# Altium project SmartGarden_PCB.PrjPcb (part 2 of 3)

## Sheet [2]MCU.SchDoc
size A4
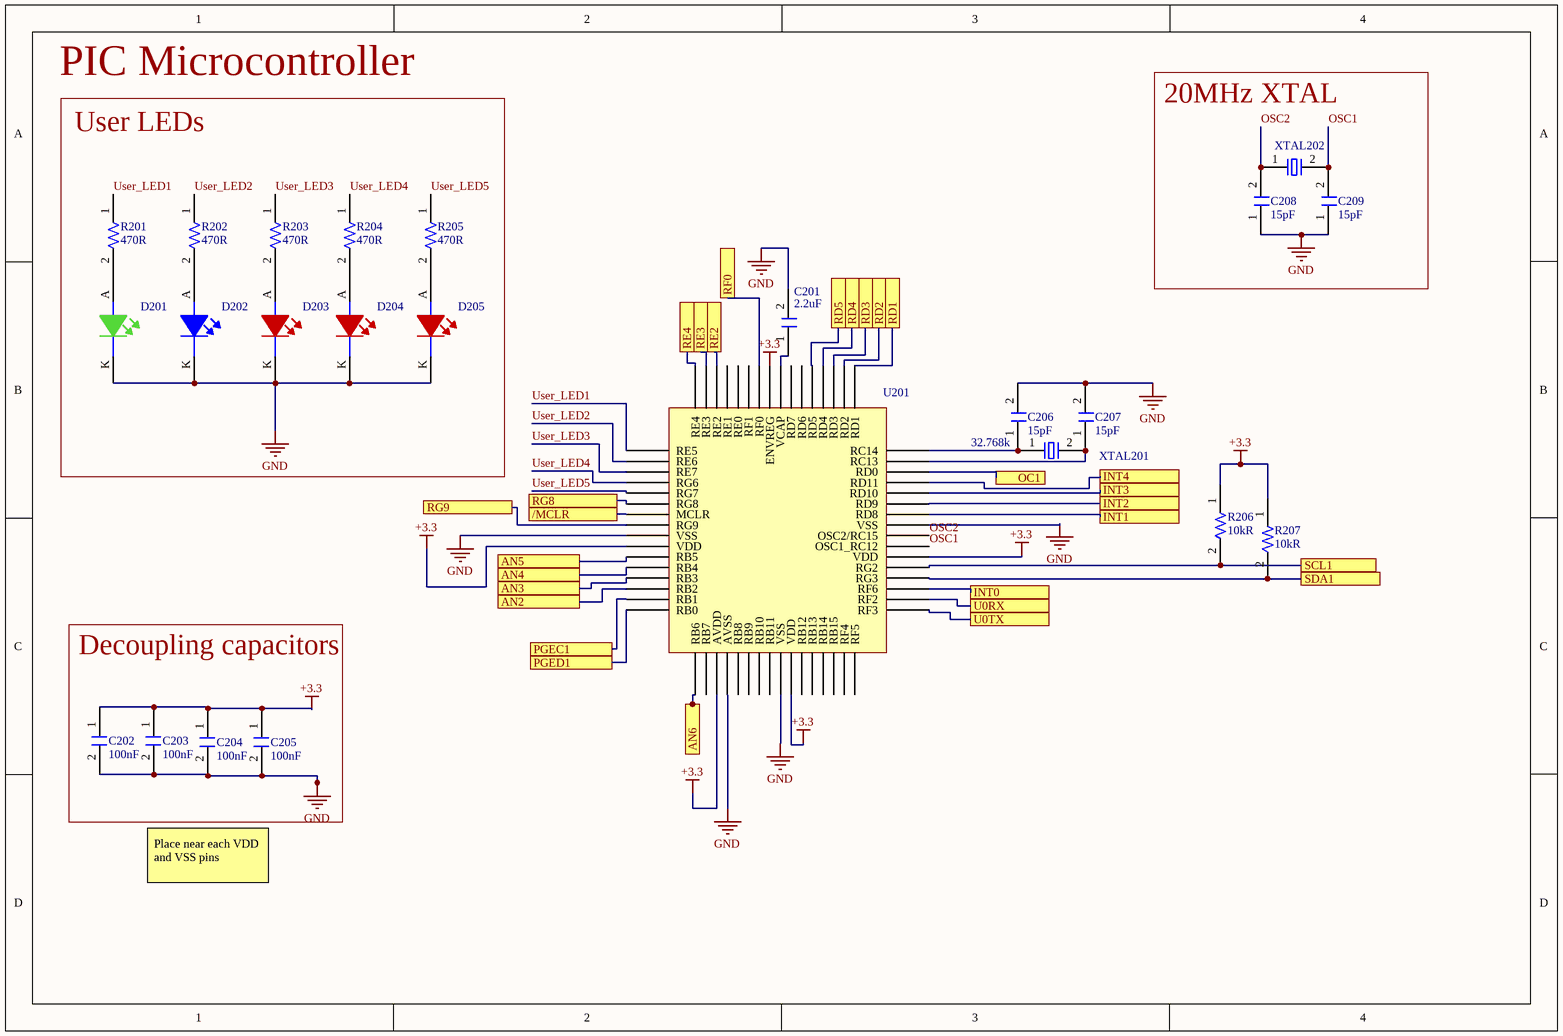
[diagram p2: [2]MCU.SchDoc]

### Parts
C201  2.2uF  [C0805FNPC-W]
C202  Capacitance: 100nF  [C0805FNPC-R]  (hidden comment: 885012207098)
C203  Capacitance: 100nF  [C0805FNPC-R]  (hidden comment: 885012207098)
C204  Capacitance: 100nF  [C0805FNPC-R]  (hidden comment: 885012207098)
C205  Capacitance: 100nF  [C0805FNPC-R]  (hidden comment: 885012207098)
C206  Capacitance: 15pF  [C1206FNPC-RW]  (hidden comment: 885012008038)
C207  Capacitance: 15pF  [C1206FNPC-RW]  (hidden comment: 885012008038)
C208  Capacitance: 15pF  [C1206FNPC-RW]  (hidden comment: 885012008038)
C209  Capacitance: 15pF  [C1206FNPC-RW]  (hidden comment: 885012008038)
D201  150080VS75000  [LED_0805_WE]  (value not drawn)
D202  150080BS75000  [LED_0805_WE]  (value not drawn)
D203  150080RS75000  [LED_0805_WE]  (value not drawn)
D204  150080RS75000  [LED_0805_WE]  (value not drawn)
D205  150080RS75000  [LED_0805_WE]  (value not drawn)
R201  Resistance: 470R  [R0805FTK]  (hidden comment: CR0805-FX-4700GLF)
R202  Resistance: 470R  [R0805FTK]  (hidden comment: CR0805-FX-4700GLF)
R203  Resistance: 470R  [R0805FTK]  (hidden comment: CR0805-FX-4700GLF)
R204  Resistance: 470R  [R0805FTK]  (hidden comment: CR0805-FX-4700GLF)
R205  Resistance: 470R  [R0805FTK]  (hidden comment: CR0805-FX-4700GLF)
R206  Resistance: 10kR  [R0805FTK]  (hidden comment: CR0805-JW-103ELF)
R207  Resistance: 10kR  [R0805FTK]  (hidden comment: CR0805-JW-103ELF)
U201  PIC32MX340F512H  [QFP50P1200X1200X120_64N]  (value not drawn)
XTAL201  32.768k  [XTAL_ABS06-32.768KHZ-9-T]
XTAL202  830028710  [XTAL20M_SMD]  (value not drawn)

### Blocks framed on the sheet
20MHz XTAL: C208 C209 XTAL202
PIC Microcontroller: D201-D205 R201-R205
Decoupling capacitors: C202-C205

### Ports
/MCLR, AN2, AN3, AN4, AN5, AN6, INT0, INT1, INT2, INT3, INT4, OC1, PGEC1, PGED1, RD1, RD2, RD3, RD4, RD5, RE2, RE3, RE4, RF0, RG8, RG9, SCL1, SDA1, U0RX, U0TX

### Nets
+3.3: C202.1 C203.1 C204.1 C205.1 R206.1 R207.1 U201.10(VDD) U201.19(AVDD) U201.26(VDD) U201.38(VDD) U201.57(ENVREG)
GND: C201.2 C202.2 C203.2 C204.2 C205.2 C206.2 C207.2 C208.1 C209.1 D201.K D202.K D203.K D204.K D205.K U201.9(VSS) U201.20(AVSS) U201.25(VSS) U201.41(VSS)
/MCLR: U201.7(MCLR) ; port /MCLR
DPS_SCL: R206.2 U201.37(RG2) ; port SCL1
DPS_SDA: R207.2 U201.36(RG3) ; port SDA1
GH_D: U201.8(RG9) ; port RG9
GH_Vout: U201.17(RB6) ; port AN6
HR_Vout: U201.11(RB5) ; port AN5
LDR_Vout: U201.13(RB3) ; port AN3
NTC_Vadc: U201.12(RB4) ; port AN4
OSC1: C209.2 U201.39(OSC1_RC12) XTAL202.2
OSC2: C208.2 U201.40(OSC2/RC15) XTAL202.1
PGEC1: U201.15(RB1) ; port PGEC1
PGED1: U201.16(RB0) ; port PGED1
Rain_D: U201.6(RG8) ; port RG8
Rain_Vout: U201.14(RB2) ; port AN2
RD1: U201.49(RD1) ; port RD1
RD2: U201.50(RD2) ; port RD2
RD3: U201.51(RD3) ; port RD3
RD4: U201.52(RD4) ; port RD4
RD5: U201.53(RD5) ; port RD5
User_LED1: R201.1 U201.1(RE5)
User_LED2: R202.1 U201.2(RE6)
User_LED3: R203.1 U201.3(RE7)
User_LED4: R204.1 U201.4(RG6)
User_LED5: R205.1 U201.5(RG7)
NetC201_1: C201.1 U201.56(VCAP)
NetC206_1: C206.1 U201.48(RC14) XTAL201.1
NetC207_1: C207.1 U201.47(RC13) XTAL201.2
NetC401_1: U201.35(RF6) ; port INT0
NetC402_1: U201.42(RD8) ; port INT1
NetC403_1: U201.43(RD9) ; port INT2
NetC404_1: U201.44(RD10) ; port INT3
NetC405_1: U201.45(RD11) ; port INT4
NetD201_A: D201.A R201.2
NetD202_A: D202.A R202.2
NetD203_A: D203.A R203.2
NetD204_A: D204.A R204.2
NetD205_A: D205.A R205.2
NetR414_1: U201.46(RD0) ; port OC1
NetR416_1: U201.58(RF0) ; port RF0
NetR418_2: U201.64(RE4) ; port RE4
NetU201_33: U201.33(RF3) ; port U0TX
NetU201_34: U201.34(RF2) ; port U0RX
NetU201_62: U201.62(RE2) ; port RE2
NetU201_63: U201.63(RE3) ; port RE3

Not connected (* = marked no-connect by the designer): U201 18(RB7) 21(RB8) 22(RB9) 23(RB10) 24(RB11) 27(RB12) 28(RB13) 29(RB14) 30(RB15) 31(RF4) 32(RF5) 54(RD6) 55(RD7) 59(RF1) 60(RE0) 61(RE1)

### Notes on the sheet
- User LEDs
- Place near each VDD and VSS pins

### Library data of the parts
C201 = C2.2u-16V-0805FTK
C202-C205 = C100n-50V-0805FNPC-X7R: Cap, 0.1ΜF, 50V, 10%, X7R, 0805; Manufacturer 1: Wurth Electronics; .Creator: DR; Supplier 1: RSComponents; Manufacturer Part Number 1: 885012207098; RoHS: Yes; Category: Ceramic Capacitors; Stock 1: 8000; Pricing 1: 100=0,10200, 500=0,07100, 2000=0,06100 (GBP); Mount: Surface Mount; Case/Package: 0805; Case Code (Metric): 2012; Case Code (Imperial): 0805; Min Operating Temperature: -55°C; Max Operating Temperature: 125°C; Packaging: Cut Tape; Voltage Rating: 50V; Dielectric: X7R; Tolerance: 10%; Voltage Rating (DC): 50V; Length: 0.079inch; Width: 0.049inch; Thickness: 0.035inch; REACH SVHC: Unknown; RoHS Compliant: Yes; ComponentLink1URL: http://www.farnell.com/datasheets/1958498.pdf?src-supplier=Farnell; ComponentLink1Description: http://www.farnell.com/datasheets/1958498.pdf?src-supplier=Farnell; ComponentLink2URL: http://www.farnell.com/datasheets/1958498.pdf?src-supplier=Element14; ComponentLink2Description: http://www.farnell.com/datasheets/1958498.pdf?src-supplier=Element14; ComponentLink3URL: https://katalog.we-online.de/pbs/datasheet/885012207098.pdf?src-supplier=Digi-Key; ComponentLink3Description: https://katalog.we-online.de/pbs/datasheet/885012207098.pdf?src-supplier=Digi-Key; ComponentLink4URL: http://www.farnell.com/datasheets/1958498.pdf?src-supplier=Newark; ComponentLink4Description: http://www.farnell.com/datasheets/1958498.pdf?src-supplier=Newark; Supplier Part Number 1: 1813493
C206-C209 = C15p-50V-1206FNPC-NP0: Cap, 15Pf, 50V, 5%, C0G/np0, 1206 Rohs Compliant: Yes; Manufacturer: Wurth Electronics; .Creator: GP; Category: Capacitor; ComponentLink1Description: Datasheet; ComponentLink1URL: https://www.we-online.com/catalog/datasheet/885012008038.pdf; ComponentLink2Description: Where buy it; ComponentLink2URL: https://www.we-online.com/catalog/en/WCAP-CSGP-50VDC?sq=885012008038#885012008038; Supplier 1: Digi-Key; Manufacturer Part Number: 885012008038; RoHS: Yes; Stock 1: 6999; Pricing 1: 1=0,11000, 10=0,10000, 100=0,09000, 500=0,08000 (USD); Mount: Surface Mount; Case/Package: 1206; Case Code (Metric): 3216; Case Code (Imperial): 1206; Min Operating Temperature: -55°C; Max Operating Temperature: 125°C; Packaging: Tape and Reel; Voltage Rating: 50V; Tolerance: 5%; Length: 0.126inch; Width: 0.063inch; Thickness: 0.035inch; RoHS Compliant: Yes; ComponentLink3URL: http://www.farnell.com/datasheets/2546700.pdf?src-supplier=Farnell; ComponentLink3Description: http://www.farnell.com/datasheets/2546700.pdf?src-supplier=Farnell; ComponentLink4URL: https://katalog.we-online.de/pbs/datasheet/885012008038.pdf?src-supplier=Digi-Key; ComponentLink4Description: https://katalog.we-online.de/pbs/datasheet/885012008038.pdf?src-supplier=Digi-Key; Supplier Part Number 1: 732-7882-1-ND
D201 = LEDVS-0805-40: Led, Green, 570 Nm, 2 V, 30 Ma, 40 Mcd Rohs Compliant: Yes; Manufacturer 1: Wurth Electronics; Luminous Intensity: 40mcd; Forward Current: 30mA; Forward Voltage: 2V; Viewing Angle: 140°; Wavelength: 570nm; Lens Style: Clear,Rectangular; Test Current: 20mA; .Creator: DR; ComponentLink1Description: Datasheet; ComponentLink1URL: https://www.we-online.com/catalog/datasheet/150080VS75000.pdf; ComponentLink2Description: Where buy it; ComponentLink2URL: https://katalog.we-online.de/en/led/WL-SMCW/150080VS75000; Supplier 1: RSComponents; Manufacturer Part Number 1: 150080VS75000; RoHS: Yes; Category: LEDs; Stock 1: 850; Pricing 1: 50=0,19300, 500=0,12900, 1000=0,12300, 2000=0,11700, 4000=0,11100 (USD); Mount: Surface Mount; Case/Package: 0805; Case Code (Metric): 2012; Case Code (Imperial): 0805; Min Operating Temperature: -40°C; Max Operating Temperature: 85°C; Package Quantity: 4000; Packaging: Tape and Reel; Dominant Wavelength: 570nm; Length: 2mm; Width: 1.25mm; Height: 0.7mm; REACH SVHC: Unknown; ComponentLink3URL: https://datasheet.ciiva.com/22656/150080vs75000-22656966.pdf?src-supplier=Element14; ComponentLink3Description: https://datasheet.ciiva.com/22656/150080vs75000-22656966.pdf?src-supplier=Element14; ComponentLink4URL: https://datasheet.ciiva.com/29279/759437-da-01-en-chipled-0805-w-kl-h-gruen-150080vs7500-29279047.pdf?src-supplier=Conrad; ComponentLink4Description: https://datasheet.ciiva.com/29279/759437-da-01-en-chipled-0805-w-kl-h-gruen-150080vs7500-29279047.pdf?src-supplier=Conrad; ComponentLink5URL: https://datasheet.ciiva.com/29563/150080vs75000-29563018.pdf?src-supplier=Digi-Key; ComponentLink5Description: https://datasheet.ciiva.com/29563/150080vs75000-29563018.pdf?src-supplier=Digi-Key; Supplier Part Number 1: 8154237; Color: Green
D202 = LEDBS-0805-145: LED BLUE CLEAR 0805 SMD; Manufacturer 1: Wurth Electronics; Luminous Intensity: 145mcd; Viewing Angle: 140°; Forward Voltage: 3.2V; Wavelength: 470nm; Lens Style: Clear,Rectangular; Forward Current: 30mA; Test Current: 20mA; .Creator: GP; ComponentLink1Description: Datasheet; ComponentLink1URL: https://www.we-online.com/catalog/datasheet/150080BS75000.pdf; ComponentLink2Description: Where buy it; ComponentLink2URL: https://katalog.we-online.de/en/led/WL-SMCW/150080BS75000; Supplier 1: RSComponents; Manufacturer Part Number 1: 150080BS75000; RoHS: Yes; Category: LEDs; Stock 1: 7400; Pricing 1: 50=0,19300, 500=0,12900, 1000=0,12200, 2000=0,11700, 4000=0,11100 (USD); Mount: Surface Mount; Case/Package: 0805; Case Code (Metric): 2012; Case Code (Imperial): 0805; Min Operating Temperature: -40°C; Max Operating Temperature: 85°C; Package Quantity: 4000; Packaging: Tape and Reel; Dominant Wavelength: 470nm; Length: 2mm; Width: 1.25mm; Height: 0.7mm; REACH SVHC: Unknown; RoHS Compliant: Yes; Lead Free: Lead Free; ComponentLink3URL: https://datasheet.ciiva.com/23843/150080bs75000-23843251.pdf?src-supplier=Newark; ComponentLink3Description: https://datasheet.ciiva.com/23843/150080bs75000-23843251.pdf?src-supplier=Newark; ComponentLink4URL: https://datasheet.ciiva.com/22656/1740214-22656954.pdf?src-supplier=Element14; ComponentLink4Description: https://datasheet.ciiva.com/22656/1740214-22656954.pdf?src-supplier=Element14; ComponentLink5URL: https://datasheet.ciiva.com/29279/759433-da-01-en-chipled-0805-w-kl-blau-150080bs75000-29279203.pdf?src-supplier=Conrad; ComponentLink5Description: https://datasheet.ciiva.com/29279/759433-da-01-en-chipled-0805-w-kl-blau-150080bs75000-29279203.pdf?src-supplier=Conrad; ComponentLink6URL: https://datasheet.ciiva.com/29562/150080bs75000-29562922.pdf?src-supplier=Digi-Key; ComponentLink6Description: https://datasheet.ciiva.com/29562/150080bs75000-29562922.pdf?src-supplier=Digi-Key; ComponentLink7URL: https://datasheet.ciiva.com/29562/150080bs75000-29562923.pdf?src-supplier=Digi-Key; ComponentLink7Description: https://datasheet.ciiva.com/29562/150080bs75000-29562923.pdf?src-supplier=Digi-Key; Supplier Part Number 1: 8154228; Color: Blue
D203-D205 = LEDRS-0805-150: 0805(H=0.8mm) 红色 高亮 λD=625nm VF=2V IF=30mA PD=72mW; Manufacturer 1: Wurth Electronics; Luminous Intensity: 150mcd; Viewing Angle: 140°; Forward Voltage: 2V; Wavelength: 625nm; Lens Style: Clear,Rectangular; Forward Current: 30mA; Test Current: 20mA; .Creator: DR; Color: Red; ComponentLink1Description: Datasheet; ComponentLink1URL: https://www.we-online.com/catalog/datasheet/150080RS75000.pdf; ComponentLink2Description: Where buy it; ComponentLink2URL: https://katalog.we-online.de/en/led/WL-SMCW/150080RS75000; Supplier 1: RSComponents; Manufacturer Part Number 1: 150080RS75000; RoHS: Yes; Category: LEDs; Stock 1: 1; Pricing 1: 50=0,19300, 500=0,12900, 1000=0,12300, 2000=0,11700, 4000=0,11100 (USD); Mount: Surface Mount; Case/Package: 0805; Case Code (Metric): 2012; Case Code (Imperial): 0805; Min Operating Temperature: -40°C; Max Operating Temperature: 85°C; Package Quantity: 4000; Packaging: Tape and Reel; Dominant Wavelength: 625nm; Length: 2mm; Width: 1.25mm; Height: 0.7mm; REACH SVHC: Unknown; RoHS Compliant: Yes; ComponentLink3URL: https://datasheet.ciiva.com/22656/150080rs75000-22656961.pdf?src-supplier=Element14; ComponentLink3Description: https://datasheet.ciiva.com/22656/150080rs75000-22656961.pdf?src-supplier=Element14; ComponentLink4URL: https://datasheet.ciiva.com/29279/759435-da-01-en-chipled-0805-w-kl-rot-150080rs75000-29279032.pdf?src-supplier=Conrad; ComponentLink4Description: https://datasheet.ciiva.com/29279/759435-da-01-en-chipled-0805-w-kl-rot-150080rs75000-29279032.pdf?src-supplier=Conrad; Supplier Part Number 1: 8154225P
R201-R205 = R470-0805FTK: Res Thick Film 0805 470 Ohm 1% 1/8W ±100ppm/°C Molded SMD SMD Paper Tape on Plastic Reel; Manufacturer 1: Bourns; Power Rating: 125mW; Voltage Rating: 150V; .Creator: DR; Supplier 1: Arrow Electronics; Manufacturer Part Number 1: CR0805-FX-4700GLF; RoHS: Yes; Category: Chip SMD Resistors; Stock 1: 12623; Pricing 1: 1=0,00990, 10=0,00980, 25=0,00950, 50=0,00940, 100=0,00930, 250=0,00920, 500=0,00910, 1000=0,00890, 3000=0,00870, 6000=0,00860 (USD); Mount: Surface Mount; Case/Package: 0805; Number of Pins: 2; Case Code (Imperial): 0805; Case Code (Metric): 2012; Contact Plating: Tin; Min Operating Temperature: -55°C; Max Operating Temperature: 155°C; Packaging: Tape and Reel; Tolerance: 1%; Resistor Type: Thick Film; Termination: SMD/SMT; Temperature Coefficient: 100ppm/°C; Voltage Rating (DC): 150V; Features: Moisture Resistant; Series: CR0805; Max Power Dissipation: 125mW; Number of Terminations: 2; Resistance Tolerance: 1%; Construction: Rectangular; Technology: THICK FILM; Length: 2mm; Height: 0.5mm; Depth: 1.25mm; Thickness: 508um; Radiation Hardening: No; REACH SVHC: No SVHC; Military Standard: Not; ComponentLink1URL: https://datasheet.ciiva.com/11808/0900766b80fcdb72-11808686.pdf?src-supplier=RSComponents; ComponentLink1Description: https://datasheet.ciiva.com/11808/0900766b80fcdb72-11808686.pdf?src-supplier=RSComponents; ComponentLink2URL: https://datasheet.ciiva.com/7985/1856384-7985880.pdf?src-supplier=Element14; ComponentLink2Description: https://datasheet.ciiva.com/7985/1856384-7985880.pdf?src-supplier=Element14; ComponentLink3URL: https://datasheet.ciiva.com/22693/1902866-22693247.pdf?src-supplier=Element14; ComponentLink3Description: https://datasheet.ciiva.com/22693/1902866-22693247.pdf?src-supplier=Element14; ComponentLink4URL: https://datasheet.ciiva.com/5541/chpreztr-5541930.pdf?src-supplier=Mouser; ComponentLink4Description: https://datasheet.ciiva.com/5541/chpreztr-5541930.pdf?src-supplier=Mouser; Supplier Part Number 1: CR0805-FX-4700GLF
R206 R207 = R10k-0805FTK: BOURNS         CR0805-JW-103ELF            Surface Mount Chip Resistor, Thick Film, CR Series, 10 kohm, 125 mW,  5%, 150 V; Temperature Coefficient: 200ppm/°C; Power Rating: 125mW; Voltage Rating: 150V; Voltage Rating (DC): 100V; .Creator: DR; Supplier 1: Arrow Electronics; Manufacturer 1: Bourns; Manufacturer Part Number 1: CR0805-JW-103ELF; RoHS: Yes; Category: Chip SMD Resistors; Stock 1: 57566; Pricing 1: 1=0,05790, 10=0,01540, 25=0,01340, 100=0,00340 (USD); Mount: Surface Mount; Case/Package: 0805; Number of Pins: 2; Contact Plating: Tin; Case Code (Metric): 2012; Case Code (Imperial): 0805; Min Operating Temperature: -55°C; Max Operating Temperature: 155°C; Tolerance: 5%; Resistor Type: Thick Film; Package Quantity: 1; Packaging: Tape and Reel; Number of Terminations: 2; Termination: SMD/SMT; Max Power Dissipation: 125mW; Features: Moisture Resistant; Series: CR0805; Construction: Rectangular; Resistance Tolerance: 5%; Technology: THICK FILM; Length: 2mm; Width: 1.25mm; Height: 0.5mm; Depth: 1.25mm; Thickness: 508um; Radiation Hardening: No; REACH SVHC: No SVHC; Military Standard: Not; RoHS Compliant: Yes; ComponentLink1URL: https://datasheet.ciiva.com/11821/0900766b80fcdb72-11821135.pdf?src-supplier=RSComponents; ComponentLink1Description: https://datasheet.ciiva.com/11821/0900766b80fcdb72-11821135.pdf?src-supplier=RSComponents; ComponentLink2URL: https://datasheet.ciiva.com/9122/chpreztr-9122374.pdf?src-supplier=Avnet; ComponentLink2Description: https://datasheet.ciiva.com/9122/chpreztr-9122374.pdf?src-supplier=Avnet; ComponentLink3URL: https://datasheet.ciiva.com/22693/1902866-22693254.pdf?src-supplier=Element14; ComponentLink3Description: https://datasheet.ciiva.com/22693/1902866-22693254.pdf?src-supplier=Element14; ComponentLink4URL: https://datasheet.ciiva.com/7986/691949-7986187.pdf?src-supplier=Element14; ComponentLink4Description: https://datasheet.ciiva.com/7986/691949-7986187.pdf?src-supplier=Element14; ComponentLink5URL: https://datasheet.ciiva.com/30065/159chpreztr-30065976.pdf?src-supplier=Onlinecomponents.com; ComponentLink5Description: https://datasheet.ciiva.com/30065/159chpreztr-30065976.pdf?src-supplier=Onlinecomponents.com; ComponentLink6URL: https://datasheet.ciiva.com/16783/70154685-16783482.pdf?src-supplier=Allied+Electronics; ComponentLink6Description: https://datasheet.ciiva.com/16783/70154685-16783482.pdf?src-supplier=Allied+Electronics; ComponentLink7URL: https://datasheet.ciiva.com/5548/chpreztr-5548491.pdf?src-supplier=Mouser; ComponentLink7Description: https://datasheet.ciiva.com/5548/chpreztr-5548491.pdf?src-supplier=Mouser; ComponentLink8URL: https://datasheet.ciiva.com/6559/chpreztr-6559900.pdf?src-supplier=Digi-Key; ComponentLink8Description: https://datasheet.ciiva.com/6559/chpreztr-6559900.pdf?src-supplier=Digi-Key; ComponentLink9URL: https://datasheet.ciiva.com/6559/chpreztr-6559901.pdf?src-supplier=Digi-Key; ComponentLink9Description: https://datasheet.ciiva.com/6559/chpreztr-6559901.pdf?src-supplier=Digi-Key; ComponentLink10URL: https://datasheet.ciiva.com/7985/1856384-7985869.pdf?src-supplier=Element14; ComponentLink10Description: https://datasheet.ciiva.com/7985/1856384-7985869.pdf?src-supplier=Element14; ComponentLink11URL: https://datasheet.ciiva.com/48692/001055517-da-01-en-smd-wid-cr0805-jw-103elf-10k-ohm-1-8w-48692118.pdf?src-supplier=Conrad; ComponentLink11Description: https://datasheet.ciiva.com/48692/001055517-da-01-en-smd-wid-cr0805-jw-103elf-10k-ohm-1-8w-48692118.pdf?src-supplier=Conrad; Supplier Part Number 1: CR0805-JW-103ELF
XTAL201 = XTAL_SMD_32.768kHz
XTAL202 = XTAL20M_SMD: 830028710, 20 MHz; Manufacturer: Würth Elektronik; Frequency: 20 MHz; Frequency Stability: +-50 ppm; Drive level: 500µW max; .Creator: GP; Category: XTAL; ComponentLink1Description: Datasheet; ComponentLink1URL: https://www.we-online.com/catalog/datasheet/830028710.pdf; ComponentLink2Description: Where buy it; Package: *; Manufacturer part number: 830028710; Supplier: Würth Elektronik; Packaging: Reel; Max operating temperature.: 85ºC; Min operating temperature: -40ºC; Max power dissipation: *; Power rating: *; RoHS: Yes; Number of pins: 2; Type: SMD; Supplier 1: Digi-Key; Stock 1: 975; Pricing 1: 1=0,37000, 10=0,28100, 50=0,26800, 100=0,24400, 500=0,22000 (USD); Supplier Part Number 1: 1923-830028710CT-ND

## Sheet [3]Sensors.SchDoc
size A4
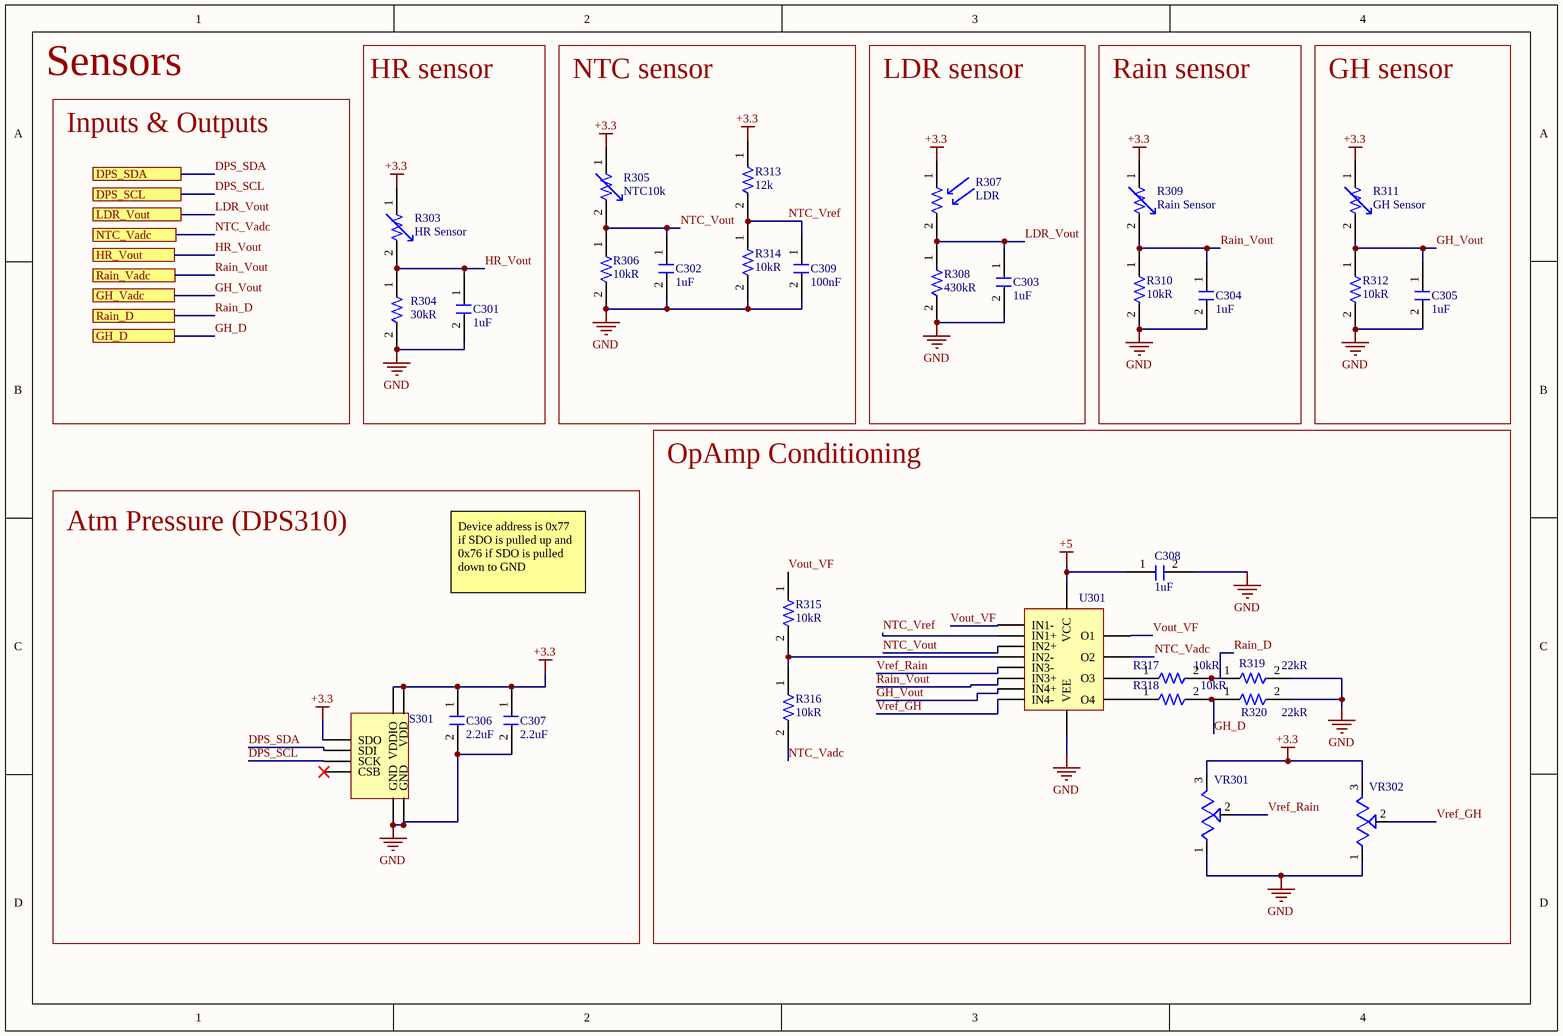
[diagram p3: [3]Sensors.SchDoc]

### Parts
C301  Capacitance: 1uF  [C1206FNPC-RW]  (hidden comment: 885012208036)
C302  Capacitance: 1uF  [C1206FNPC-RW]  (hidden comment: 885012208036)
C303  Capacitance: 1uF  [C1206FNPC-RW]  (hidden comment: 885012208036)
C304  Capacitance: 1uF  [C1206FNPC-RW]  (hidden comment: 885012208036)
C305  Capacitance: 1uF  [C1206FNPC-RW]  (hidden comment: 885012208036)
C306  2.2uF  [C0805FNPC-W]
C307  2.2uF  [C0805FNPC-W]
C308  Capacitance: 1uF  [C1206FNPC-RW]  (hidden comment: 885012208036)
C309  Capacitance: 100nF  [C1206FNPC-RW]  (hidden comment: 885012208009)
R303  HR Sensor  [HR_Sensor]
R304  Resistance: 30kR  [R1206FTK-W]  (hidden comment: CRCW120630K0FKEA)
R305  NTC10k  [NTC10k_0805]
R306  Resistance: 10kR  [R0805FTK]  (hidden comment: CR0805-JW-103ELF)
R307  LDR  [HR_Sensor]
R308  430kR  [R0805FTK]
R309  Rain Sensor  [EXTERNAL_SENSOR]
R310  Resistance: 10kR  [R0805FTK]  (hidden comment: CR0805-JW-103ELF)
R311  GH Sensor  [EXTERNAL_SENSOR]
R312  Resistance: 10kR  [R0805FTK]  (hidden comment: CR0805-JW-103ELF)
R313  12k  [R1206]
R314  Resistance: 10kR  [R0805FTK]  (hidden comment: CR0805-JW-103ELF)
R315  Resistance: 10kR  [R0805FTK]  (hidden comment: CR0805-JW-103ELF)
R316  Resistance: 10kR  [R0805FTK]  (hidden comment: CR0805-JW-103ELF)
R317  Resistance: 10kR  [R0805FTK]  (hidden comment: CR0805-JW-103ELF)
R318  Resistance: 10kR  [R0805FTK]  (hidden comment: CR0805-JW-103ELF)
R319  22kR  [R0805FTK]
R320  22kR  [R0805FTK]
S301  DPS310XTSA1  [XDCR_DPS310XTSA1]  (value not drawn)
U301  OpAmp  [LM324_OpAmp]  (value not drawn)
VR301  Trimmer_10k_THT  [TRIM_3362P-1-103LF]  (value not drawn)
VR302  Trimmer_10k_THT  [TRIM_3362P-1-103LF]  (value not drawn)

### Blocks framed on the sheet
HR sensor: C301 R303 R304
NTC sensor: C302 C309 R305 R306 R313 R314
LDR sensor: C303 R307 R308
Rain sensor: C304 R309 R310
GH sensor: C305 R311 R312
OpAmp Conditioning: C308 R315-R320 U301 VR301 VR302
Atm Pressure (DPS310): C306 C307 S301

### Ports
DPS_SCL, DPS_SDA, GH_D, GH_Vadc, HR_Vout, LDR_Vout, NTC_Vadc, Rain_D, Rain_Vadc

### Nets
+3.3: C306.1 C307.1 R303.1 R305.1 R307.1 R309.1 R311.1 R313.1 S301.5(SDO) S301.6(VDDIO) S301.8(VDD) VR301.3(CW) VR302.3(CW)
+5: C308.1 U301.4(VCC)
GND: C301.2 C302.2 C303.2 C304.2 C305.2 C306.2 C307.2 C308.2 C309.2 R304.2 R306.2 R308.2 R310.2 R312.2 R314.2 R319.2 R320.2 S301.1(GND) S301.7(GND) U301.11(VEE) VR301.1(CCW) VR302.1(CCW)
DPS_SCL: S301.4(SCK) ; port DPS_SCL
DPS_SDA: S301.3(SDI) ; port DPS_SDA
GH_D: R318.2 R320.1 ; port GH_D
GH_Vout: C305.1 R311.2 R312.1 U301.12(IN4+) ; port GH_Vadc
HR_Vout: C301.1 R303.2 R304.1 ; port HR_Vout
LDR_Vout: C303.1 R307.2 R308.1 ; port LDR_Vout
NTC_Vadc: R316.2 U301.7(O2) ; port NTC_Vadc
NTC_Vout: C302.1 R305.2 R306.1 U301.5(IN2+)
NTC_Vref: C309.1 R313.2 R314.1 U301.3(IN1+)
Rain_D: R317.2 R319.1 ; port Rain_D
Rain_Vout: C304.1 R309.2 R310.1 U301.10(IN3+) ; port Rain_Vadc
Vout_VF: R315.1 U301.1(O1) U301.2(IN1-)
Vref_GH: U301.13(IN4-) VR302.2(WIPER)
Vref_Rain: U301.9(IN3-) VR301.2(WIPER)
NetR315_2: R315.2 R316.1 U301.6(IN2-)
NetR317_1: R317.1 U301.8(O3)
NetR318_1: R318.1 U301.14(O4)

Not connected (* = marked no-connect by the designer): S301 2(CSB)*

### Notes on the sheet
- Sensors
- Inputs & Outputs
- Device address is 0x77 if SDO is pulled up and 0x76 if SDO is pulled down to GND

### Library data of the parts
C301-C305 C308 = C1u-16V-1206FNPC-X7R: Cap Cer 1UF 16V X7R 1206; Manufacturer: Wurth Electronics; Tolerance: 10%; .Creator: GP; Category: Capacitor; ComponentLink1Description: Datasheet; ComponentLink1URL: https://www.we-online.com/catalog/datasheet/885012208036.pdf; ComponentLink2Description: Where buy it; ComponentLink2URL: https://www.we-online.com/catalog/en/WCAP-CSGP-16VDC#885012208036; Supplier 1: Mouser; Manufacturer Part Number: 885012208036; RoHS: Yes; Stock 1: 5938; Pricing 1: 1=0,15000, 10=0,13900, 50=0,13900, 100=0,12400, 500=0,11000, 1000=0,11000, 3000=0,09100, 10000=0,09100 (USD); Mount: Surface Mount; Case/Package: 1206; Case Code (Metric): 3216; Case Code (Imperial): 1206; Min Operating Temperature: -55°C; Max Operating Temperature: 125°C; Packaging: Tape and Reel; Voltage Rating: 16V; Length: 0.126inch; Width: 0.063inch; Thickness: 0.051inch; RoHS Compliant: Yes; Supplier Part Number 1: 710-885012208036
C306 C307 = C2.2u-16V-0805FTK
C309 = C100n-10V-1206FNPC-X7R: Cap, 0.1ΜF, 10V, 10%, X7R, 1206; Manufacturer 1: Wurth Electronics; .Creator: GP; Supplier 1: Digi-Key; Manufacturer Part Number 1: 885012208009; RoHS: Yes; Category: Ceramic Capacitors; Stock 1: 7198; Pricing 1: 1=0,11000, 10=0,10300, 100=0,09200, 500=0,08100 (USD); Mount: Surface Mount; Case/Package: 1206; Case Code (Metric): 3216; Case Code (Imperial): 1206; Min Operating Temperature: -55°C; Max Operating Temperature: 125°C; Packaging: Tape and Reel; Voltage Rating: 10V; Tolerance: 10%; Length: 0.126inch; Width: 0.063inch; Thickness: 0.035inch; RoHS Compliant: Yes; ComponentLink1URL: http://www.farnell.com/datasheets/2031891.pdf?src-supplier=Farnell; ComponentLink1Description: http://www.farnell.com/datasheets/2031891.pdf?src-supplier=Farnell; ComponentLink2URL: http://katalog.we-online.de/pbs/datasheet/885012208009.pdf?src-supplier=Digi-Key; ComponentLink2Description: http://katalog.we-online.de/pbs/datasheet/885012208009.pdf?src-supplier=Digi-Key; ComponentLink3URL: https://katalog.we-online.de/pbs/datasheet/885012208009.pdf?src-supplier=Digi-Key; ComponentLink3Description: https://katalog.we-online.de/pbs/datasheet/885012208009.pdf?src-supplier=Digi-Key; Supplier Part Number 1: 732-8086-1-ND; ComponentLink4Description: Wurth Elektronik; ComponentLink4URL: https://www.we-online.com/catalog/en/WCAP-CSGP-10VDC?sq=885012208009#885012208009
R303 = Resistive_HR_Sensor: Resistive HR Sensor. R30k at 60%@25ºC
R304 = R30k-1206FTK: Res Thick Film 1206 30K Ohm 1% 1/4W ±100ppm/°C Molded SMD SMD Paper T/R; Manufacturer: Vishay; Power Rating: 250mW; Voltage Rating: 200V; .Creator: GP; Category: Resistor; ComponentLink1Description: Datasheet; ComponentLink1URL: https://docs.rs-online.com/bca8/A700000006404581.pdf; ComponentLink2Description: Where buy it; ComponentLink2URL: https://es.rs-online.com/web/p/resistencias-de-montaje-en-superficie/6792039; Supplier 1: RSComponents; Manufacturer Part Number: CRCW120630K0FKEA; RoHS: Yes; Stock 1: 3550; Pricing 1: 50=0,12000, 500=0,11200, 1000=0,10400, 2000=0,09700, 4000=0,08900 (USD); Case/Package: 1206; Number of Pins: 2; Contact Plating: Tin; Case Code (Imperial): 1206; Case Code (Metric): 3216; Weight: 0.000353oz; Size Code: 1206; Min Operating Temperature: -55°C; Max Operating Temperature: 155°C; Tolerance: 1%; Resistor Type: Thick Film; Packaging: Tape and Reel; Temperature Coefficient: 100ppm/°C; Package Quantity: 10; Termination: SMD/SMT; Number of Terminations: 2; Max Power Dissipation: 250mW; Features: Automotive AEC-Q200; Series: CRCW; Construction: Rectangular; Resistance Tolerance: 1%; Technology: THICK FILM; Length: 3.2mm; Width: 1.6mm; Height: 0.55mm; Depth: 1.6mm; Radiation Hardening: No; RoHS Compliant: Yes; REACH SVHC: Unknown; Military Standard: Not; Supplier Part Number 1: 6792039
R305 = NTC_10k_0805
R306 R310 R312 R314-R318 = R10k-0805FTK: as R206 on sheet [2]MCU; Supplier 1: Arrow Electronics; Manufacturer 1: Bourns; Manufacturer Part Number 1: CR0805-JW-103ELF; RoHS: Yes; Category: Chip SMD Resistors; Stock 1: 57566; Pricing 1: 1=0,05790, 10=0,01540, 25=0,01340, 100=0,00340 (USD); Mount: Surface Mount; Case/Package: 0805; Number of Pins: 2; Contact Plating: Tin; Case Code (Metric): 2012; Case Code (Imperial): 0805; Min Operating Temperature: -55°C; Max Operating Temperature: 155°C; Tolerance: 5%; Resistor Type: Thick Film; Package Quantity: 1; Packaging: Tape and Reel; Number of Terminations: 2; Termination: SMD/SMT; Max Power Dissipation: 125mW; Features: Moisture Resistant; Series: CR0805; Construction: Rectangular; Resistance Tolerance: 5%; Technology: THICK FILM; Length: 2mm; Width: 1.25mm; Height: 0.5mm; Depth: 1.25mm; Thickness: 508um; Radiation Hardening: No; REACH SVHC: No SVHC; Military Standard: Not; RoHS Compliant: Yes; ComponentLink1URL: https://datasheet.ciiva.com/11821/0900766b80fcdb72-11821135.pdf?src-supplier=RSComponents; ComponentLink1Description: https://datasheet.ciiva.com/11821/0900766b80fcdb72-11821135.pdf?src-supplier=RSComponents; ComponentLink2URL: https://datasheet.ciiva.com/9122/chpreztr-9122374.pdf?src-supplier=Avnet; ComponentLink2Description: https://datasheet.ciiva.com/9122/chpreztr-9122374.pdf?src-supplier=Avnet; ComponentLink3URL: https://datasheet.ciiva.com/22693/1902866-22693254.pdf?src-supplier=Element14; ComponentLink3Description: https://datasheet.ciiva.com/22693/1902866-22693254.pdf?src-supplier=Element14; ComponentLink4URL: https://datasheet.ciiva.com/7986/691949-7986187.pdf?src-supplier=Element14; ComponentLink4Description: https://datasheet.ciiva.com/7986/691949-7986187.pdf?src-supplier=Element14; ComponentLink5URL: https://datasheet.ciiva.com/30065/159chpreztr-30065976.pdf?src-supplier=Onlinecomponents.com; ComponentLink5Description: https://datasheet.ciiva.com/30065/159chpreztr-30065976.pdf?src-supplier=Onlinecomponents.com; ComponentLink6URL: https://datasheet.ciiva.com/16783/70154685-16783482.pdf?src-supplier=Allied+Electronics; ComponentLink6Description: https://datasheet.ciiva.com/16783/70154685-16783482.pdf?src-supplier=Allied+Electronics; ComponentLink7URL: https://datasheet.ciiva.com/5548/chpreztr-5548491.pdf?src-supplier=Mouser; ComponentLink7Description: https://datasheet.ciiva.com/5548/chpreztr-5548491.pdf?src-supplier=Mouser; ComponentLink8URL: https://datasheet.ciiva.com/6559/chpreztr-6559900.pdf?src-supplier=Digi-Key; ComponentLink8Description: https://datasheet.ciiva.com/6559/chpreztr-6559900.pdf?src-supplier=Digi-Key; ComponentLink9URL: https://datasheet.ciiva.com/6559/chpreztr-6559901.pdf?src-supplier=Digi-Key; ComponentLink9Description: https://datasheet.ciiva.com/6559/chpreztr-6559901.pdf?src-supplier=Digi-Key; ComponentLink10URL: https://datasheet.ciiva.com/7985/1856384-7985869.pdf?src-supplier=Element14; ComponentLink10Description: https://datasheet.ciiva.com/7985/1856384-7985869.pdf?src-supplier=Element14; ComponentLink11URL: https://datasheet.ciiva.com/48692/001055517-da-01-en-smd-wid-cr0805-jw-103elf-10k-ohm-1-8w-48692118.pdf?src-supplier=Conrad; ComponentLink11Description: https://datasheet.ciiva.com/48692/001055517-da-01-en-smd-wid-cr0805-jw-103elf-10k-ohm-1-8w-48692118.pdf?src-supplier=Conrad; Supplier Part Number 1: CR0805-JW-103ELF
R307 = LDR_LightSensor
R308 = R430k-0805FTK
R309 = RainSensor_Resisitve
R311 = GH_Resistive_Sensor
R313 = R12k-1206
R319 R320 = R22k-0805FTK
S301 = AtmPressureSensor_DPS310XTSA1: DPS310 Digital Pressure Sensor
U301 = LM324_OpAmp
VR301 VR302 = Trimmer_10k_THT: Trimmer, Cermet, Rest 10 Kilohms, PCB, 1 Turns, Pwr-Rtg 0.5 W, Tol 10% | Bourns 3362P-1-103LF; SnapEDA_Link: https://www.snapeda.com/parts/3362P-1-103LF/Bourns/view-part/?ref=snap; Package: 3362P-1 Bourns Inc.; Value: *; MF: Bourns; MP: 3362P-1-103LF; Check_prices: https://www.snapeda.com/parts/3362P-1-103LF/Bourns/view-part/?ref=eda

## Sheet [4]Actuators.SchDoc
size A4
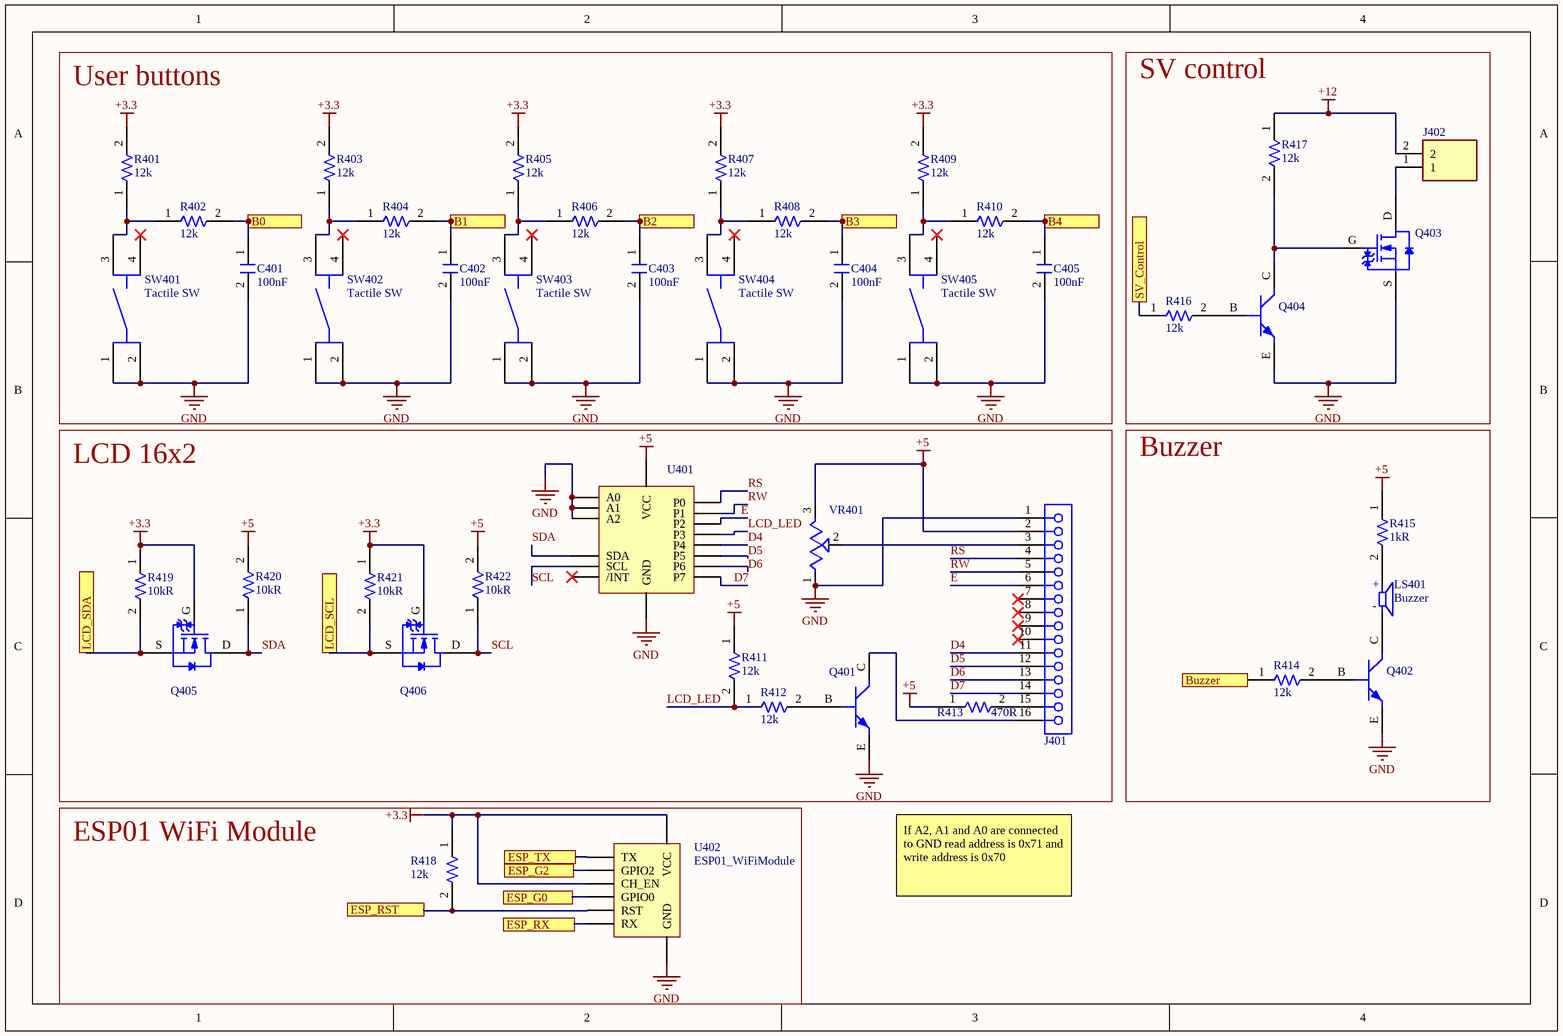
[diagram p4: [4]Actuators.SchDoc]

### Parts
C401  Capacitance: 100nF  [C1206FNPC-RW]  (hidden comment: 885012208009)
C402  Capacitance: 100nF  [C1206FNPC-RW]  (hidden comment: 885012208009)
C403  Capacitance: 100nF  [C1206FNPC-RW]  (hidden comment: 885012208009)
C404  Capacitance: 100nF  [C1206FNPC-RW]  (hidden comment: 885012208009)
C405  Capacitance: 100nF  [C1206FNPC-RW]  (hidden comment: 885012208009)
J401  16 SH  [SocketHeader_16_254]  (value not drawn)
J402  J_2_CableContact  [TE_282834-2]  (value not drawn)
LS401  Buzzer  [CUI_CMI-1275C-050]
Q401  BC817-25LT1G  [TRT-NPN-0.5/45-SOT23]  (value not drawn)
Q402  BC817-25LT1G  [TRT-NPN-0.5/45-SOT23]  (value not drawn)
Q403  TRT_NCH_FDN327N  [SuperSOT3]  (value not drawn)
Q404  BC817-25LT1G  [TRT-NPN-0.5/45-SOT23]  (value not drawn)
Q405  TRT_NCH_FDN327N  [SuperSOT3]  (value not drawn)
Q406  TRT_NCH_FDN327N  [SuperSOT3]  (value not drawn)
R401  12k  [R1206]
R402  12k  [R1206]
R403  12k  [R1206]
R404  12k  [R1206]
R405  12k  [R1206]
R406  12k  [R1206]
R407  12k  [R1206]
R408  12k  [R1206]
R409  12k  [R1206]
R410  12k  [R1206]
R411  12k  [R1206]
R412  12k  [R1206]
R413  Resistance: 470R  [R0805FTK]  (hidden comment: CR0805-FX-4700GLF)
R414  12k  [R1206]
R415  Resistance: 1kR  [R0805FTK]  (hidden comment: CR0805-JW-102ELF)
R416  12k  [R1206]
R417  12k  [R1206]
R418  12k  [R1206]
R419  Resistance: 10kR  [R0805FTK]  (hidden comment: CR0805-JW-103ELF)
R420  Resistance: 10kR  [R0805FTK]  (hidden comment: CR0805-JW-103ELF)
R421  Resistance: 10kR  [R0805FTK]  (hidden comment: CR0805-JW-103ELF)
R422  Resistance: 10kR  [R0805FTK]  (hidden comment: CR0805-JW-103ELF)
SW401  Tactile SW  [SW_2-1437565-7]
SW402  Tactile SW  [SW_2-1437565-7]
SW403  Tactile SW  [SW_2-1437565-7]
SW404  Tactile SW  [SW_2-1437565-7]
SW405  Tactile SW  [SW_2-1437565-7]
U401  PCF8574ADW_I2C_8bit_I/O_Expander  [PCF8574A_SOIC16]  (value not drawn)
U402  ESP01_WiFiModule  [Dual socket header 8 pins]
VR401  Trimmer_10k_THT  [TRIM_3362P-1-103LF]  (value not drawn)

### Blocks framed on the sheet
User buttons: C401-C405 R401-R410 SW401-SW405
SV control: J402 Q403 Q404 R416 R417
LCD 16x2: J401 Q401 Q405 Q406 R411-R413 R419-R422 U401 VR401
Buzzer: LS401 Q402 R414 R415
ESP01 WiFi Module: R418 U402

### Ports
B0, B1, B2, B3, B4, Buzzer, ESP_G0, ESP_G2, ESP_RST, ESP_RX, ESP_TX, LCD_SCL, LCD_SDA, SV_Control

### Nets
+3.3: Q405.G Q406.G R401.2 R403.2 R405.2 R407.2 R409.2 R418.1 R419.1 R421.1 U402.4(CH_EN) U402.8(VCC)
+5: J401.2 R411.1 R413.1 R415.1 R420.2 R422.2 U401.16(VCC) VR401.3(CW)
+12: J402.2 R417.1
GND: C401.2 C402.2 C403.2 C404.2 C405.2 J401.1 Q401.E Q402.E Q403.S Q404.E SW401.1 SW401.2 SW402.1 SW402.2 SW403.1 SW403.2 SW404.1 SW404.2 SW405.1 SW405.2 U401.1(A0) U401.2(A1) U401.3(A2) U401.8(GND) U402.1(GND) VR401.1(CCW)
D4: J401.11 U401.9(P4)
D5: J401.12 U401.10(P5)
D6: J401.13 U401.11(P6)
D7: J401.14 U401.12(P7)
DPS_SCL: Q406.S R421.2 ; port LCD_SCL
DPS_SDA: Q405.S R419.2 ; port LCD_SDA
E: J401.6 U401.6(P2)
LCD_LED: R411.2 R412.1 U401.7(P3)
RS: J401.4 U401.4(P0)
RW: J401.5 U401.5(P1)
SCL: Q406.D R422.1 U401.14(SCL)
SDA: Q405.D R420.1 U401.15(SDA)
NetC401_1: C401.1 R402.2 ; port B0
NetC402_1: C402.1 R404.2 ; port B1
NetC403_1: C403.1 R406.2 ; port B2
NetC404_1: C404.1 R408.2 ; port B3
NetC405_1: C405.1 R410.2 ; port B4
NetJ401_3: J401.3 VR401.2(WIPER)
NetJ401_15: J401.15 R413.2
NetJ401_16: J401.16 Q401.C
NetJ402_1: J402.1 Q403.D
NetLS401_N: LS401.N Q402.C
NetLS401_P: LS401.P R415.2
NetQ401_B: Q401.B R412.2
NetQ402_B: Q402.B R414.2
NetQ403_G: Q403.G Q404.C R417.2
NetQ404_B: Q404.B R416.2
NetR401_1: R401.1 R402.1 SW401.3
NetR403_1: R403.1 R404.1 SW402.3
NetR405_1: R405.1 R406.1 SW403.3
NetR407_1: R407.1 R408.1 SW404.3
NetR409_1: R409.1 R410.1 SW405.3
NetR414_1: R414.1 ; port Buzzer
NetR416_1: R416.1 ; port SV_Control
NetR418_2: R418.2 U402.6(RST) ; port ESP_RST
NetU201_33: U402.7(RX) ; port ESP_RX
NetU201_34: U402.2(TX) ; port ESP_TX
NetU201_62: U402.5(GPIO0) ; port ESP_G0
NetU201_63: U402.3(GPIO2) ; port ESP_G2

Not connected (* = marked no-connect by the designer): J401 7* 8* 9* 10*; SW401 4*; SW402 4*; SW403 4*; SW404 4*; SW405 4*; U401 13(/INT)*

### Notes on the sheet
- If A2, A1 and A0 are connected to GND read address is 0x71 and write address is 0x70
- (in symbol Buzzer_CMI-1275C-050) +; -

### Library data of the parts
C401-C405 = C100n-10V-1206FNPC-X7R: as C309 on sheet [3]Sensors; Supplier 1: Digi-Key; Manufacturer Part Number 1: 885012208009; RoHS: Yes; Category: Ceramic Capacitors; Stock 1: 7198; Pricing 1: 1=0,11000, 10=0,10300, 100=0,09200, 500=0,08100 (USD); Mount: Surface Mount; Case/Package: 1206; Case Code (Metric): 3216; Case Code (Imperial): 1206; Min Operating Temperature: -55°C; Max Operating Temperature: 125°C; Packaging: Tape and Reel; Voltage Rating: 10V; Tolerance: 10%; Length: 0.126inch; Width: 0.063inch; Thickness: 0.035inch; RoHS Compliant: Yes; ComponentLink1URL: http://www.farnell.com/datasheets/2031891.pdf?src-supplier=Farnell; ComponentLink1Description: http://www.farnell.com/datasheets/2031891.pdf?src-supplier=Farnell; ComponentLink2URL: http://katalog.we-online.de/pbs/datasheet/885012208009.pdf?src-supplier=Digi-Key; ComponentLink2Description: http://katalog.we-online.de/pbs/datasheet/885012208009.pdf?src-supplier=Digi-Key; ComponentLink3URL: https://katalog.we-online.de/pbs/datasheet/885012208009.pdf?src-supplier=Digi-Key; ComponentLink3Description: https://katalog.we-online.de/pbs/datasheet/885012208009.pdf?src-supplier=Digi-Key; Supplier Part Number 1: 732-8086-1-ND; ComponentLink4Description: Wurth Elektronik; ComponentLink4URL: https://www.we-online.com/catalog/en/WCAP-CSGP-10VDC?sq=885012208009#885012208009
J401 = Socket_Header_16_2.54: WR-PHD Socket Header, THT, Vertical, pitch 2.54mm, 1 Row, 16P; Manufacturer Part Number: 61301611821; Manufacturer: Wurth Elektronik; Contact Resistance: 20mΩ; Rated Current: 3A; Working Voltage: 250V; Withstanding Voltage: 500V; ComponentLink1Description: Website Link; ComponentLink1URL: https://www.we-online.com/redexpert/article/61301611821?ad; ComponentLink2Description: Datasheet Link; ComponentLink2URL: https://www.we-online.com/redexpert/spec/61301611821?ad; Category: Board-to-Board Connectors; Match Code: WR-PHD; Mount: Through Hole; Operating Temperature Max: 125°C; Operating Temperature Min: -40°C; Packaging: Tray; Gender: Socket Header; Number of Pins: 16; Number of Rows: 1; Orientation: Vertical; Pitch: 2.54mm
J402 = J_2_CableContact: MP: 282834-2; MF: {'manufacturer': u'TE Connectivity'}; Value: *; Availability: Unavailable; Package: None; Price: None
LS401 = Buzzer_CMI-1275C-050: 12 mm, 5 Vdc, 90 dB, 3.1 kHz, Through Hole, Magnetic Audio Indicator Buzzer; MF: CUI Devices; SnapEDA_Link: https://www.snapeda.com/parts/CMI-1275C-050/CUI%20Devices/view-part/2772244/?ref=snap; Price: None; Mouser-Purchase-URL: https://snapeda.com/shop?store=Mouser&id=2772244; CUI_purchase_URL: https://www.cuidevices.com/product/audio/buzzers/audio-indicators/cmi-1275c-050?utm_source=snapeda.com&utm_medium=referral&utm_campaign=snapedaBOM; DigiKey-Purchase-URL: https://snapeda.com/shop?store=DigiKey&id=2772244; Value: *; MP: CMI-1275C-050; Package: TO-220 CUI Inc.; Availability: Unavailable
Q401 Q402 Q404 = TRT-NPN-0.5/45-SOT23: ON Semi BC817-25LT1G NPN Bipolar Transistor; 0.5 A; 45 V; 3-Pin SOT-23; Collector Emitter Voltage (VCEO): 45V; Max Collector Current: 500mA; Collector Base Voltage (VCBO): 50V; Power Dissipation: 300mW; hFE Min: 160; Transition Frequency: 100MHz; Emitter Base Voltage (VEBO): 5V; Element Configuration: Single; Collector-emitter Voltage-Max: 700mV; Number of Elements: 1; .Creator: GP; Category: Transistor; ComponentLink1Description: Datasheet; ComponentLink1URL: *; ComponentLink2Description: Where buy it; ComponentLink2URL: *; Package: *; Type: *; Manufacturer: *; Manufacturer part number: *; Supplier: *; Packaging: *; Max operating temperature: *; Min operating temperature: *; Max power dissipation: *; Power rating: *; RoHS: *; Polarity: *; Vce max: *; Ic max: *; Gain: *; Supplier 1: Digi-Key; Pricing 1: 1=0,20000, 10=0,18500, 100=0,10080, 500=0,06204, 1000=0,04229 (USD); Case/Package: SOT-23-3; Number of Pins: 3; Contact Plating: Tin,Matte; Package Quantity: 1; Collector Emitter Breakdown Voltage: 45V; Max Breakdown Voltage: 45V; Max Frequency: 100MHz; Current Rating: 500mA; Series: -; Frequency: 100MHz; Collector Emitter Saturation Voltage: 700mV; Gain Bandwidth Product: 100MHz; Length: 2.9mm; Width: 1.3mm; Height: 0.94mm; Radiation Hardening: No; Lead Free: Lead Free; Halogen Free: Halogen Free; RoHS Compliant: Yes; REACH SVHC: No SVHC; ComponentLink3URL: https://datasheet.ciiva.com/27748/2010413-27748829.pdf?src-supplier=Jameco; ComponentLink3Description: https://datasheet.ciiva.com/27748/2010413-27748829.pdf?src-supplier=Jameco; ComponentLink4URL: https://datasheet.ciiva.com/15138/getdatasheetpartid-38405-15138602.pdf?src-supplier=Verical; ComponentLink4Description: https://datasheet.ciiva.com/15138/getdatasheetpartid-38405-15138602.pdf?src-supplier=Verical; ComponentLink5URL: https://datasheet.ciiva.com/1196/bc817-16lt1-d-1196558.pdf?src-supplier=Element14; ComponentLink5Description: https://datasheet.ciiva.com/1196/bc817-16lt1-d-1196558.pdf?src-supplier=Element14; ComponentLink6URL: https://datasheet.ciiva.com/22641/bc817-16lt1-d-22641013.pdf?src-supplier=Farnell; ComponentLink6Description: https://datasheet.ciiva.com/22641/bc817-16lt1-d-22641013.pdf?src-supplier=Farnell; ComponentLink7URL: https://datasheet.ciiva.com/22664/bc817-16lt1-d-22664204.pdf?src-supplier=Element14; ComponentLink7Description: https://datasheet.ciiva.com/22664/bc817-16lt1-d-22664204.pdf?src-supplier=Element14; ComponentLink8URL: https://datasheet.ciiva.com/22664/1842041-22664101.pdf?src-supplier=Element14; ComponentLink8Description: https://datasheet.ciiva.com/22664/1842041-22664101.pdf?src-supplier=Element14; ComponentLink9URL: https://datasheet.ciiva.com/4722/bc817-16lt1-d-104560-4722229.pdf?src-supplier=Mouser; ComponentLink9Description: https://datasheet.ciiva.com/4722/bc817-16lt1-d-104560-4722229.pdf?src-supplier=Mouser; ComponentLink10URL: https://datasheet.ciiva.com/1195/bc817-16lt1-d-1195763.pdf?src-supplier=Element14; ComponentLink10Description: https://datasheet.ciiva.com/1195/bc817-16lt1-d-1195763.pdf?src-supplier=Element14; ComponentLink11URL: https://datasheet.ciiva.com/1195/bc817-16lt1-d-1195764.pdf?src-supplier=Element14; ComponentLink11Description: https://datasheet.ciiva.com/1195/bc817-16lt1-d-1195764.pdf?src-supplier=Element14; ComponentLink12URL: https://datasheet.ciiva.com/11197/bc817-16lt1-d-11197514.pdf?src-supplier=Avnet; ComponentLink12Description: https://datasheet.ciiva.com/11197/bc817-16lt1-d-11197514.pdf?src-supplier=Avnet; ComponentLink13URL: https://datasheet.ciiva.com/25996/bc817-16lt1-d-25996327.pdf?src-supplier=Avnet+Europe; ComponentLink13Description: https://datasheet.ciiva.com/25996/bc817-16lt1-d-25996327.pdf?src-supplier=Avnet+Europe; ComponentLink14URL: https://datasheet.ciiva.com/976/bc817-16lt1-d-976357.pdf?src-supplier=Digi-Key; ComponentLink14Description: https://datasheet.ciiva.com/976/bc817-16lt1-d-976357.pdf?src-supplier=Digi-Key; ComponentLink15URL: https://datasheet.ciiva.com/976/bc817-16lt1-d-976358.pdf?src-supplier=Digi-Key; ComponentLink15Description: https://datasheet.ciiva.com/976/bc817-16lt1-d-976358.pdf?src-supplier=Digi-Key; ComponentLink16URL: https://datasheet.ciiva.com/976/bc817-16lt1-d-976356.pdf?src-supplier=Digi-Key; ComponentLink16Description: https://datasheet.ciiva.com/976/bc817-16lt1-d-976356.pdf?src-supplier=Digi-Key; Supplier Part Number 1: BC817-25LT1GOSCT-ND
R401-R412 R414 R416-R418 = R12k-1206
R413 = R470-0805FTK: as R201 on sheet [2]MCU; Supplier 1: Arrow Electronics; Manufacturer Part Number 1: CR0805-FX-4700GLF; RoHS: Yes; Category: Chip SMD Resistors; Stock 1: 12623; Pricing 1: 1=0,00990, 10=0,00980, 25=0,00950, 50=0,00940, 100=0,00930, 250=0,00920, 500=0,00910, 1000=0,00890, 3000=0,00870, 6000=0,00860 (USD); Mount: Surface Mount; Case/Package: 0805; Number of Pins: 2; Case Code (Imperial): 0805; Case Code (Metric): 2012; Contact Plating: Tin; Min Operating Temperature: -55°C; Max Operating Temperature: 155°C; Packaging: Tape and Reel; Tolerance: 1%; Resistor Type: Thick Film; Termination: SMD/SMT; Temperature Coefficient: 100ppm/°C; Voltage Rating (DC): 150V; Features: Moisture Resistant; Series: CR0805; Max Power Dissipation: 125mW; Number of Terminations: 2; Resistance Tolerance: 1%; Construction: Rectangular; Technology: THICK FILM; Length: 2mm; Height: 0.5mm; Depth: 1.25mm; Thickness: 508um; Radiation Hardening: No; REACH SVHC: No SVHC; Military Standard: Not; ComponentLink1URL: https://datasheet.ciiva.com/11808/0900766b80fcdb72-11808686.pdf?src-supplier=RSComponents; ComponentLink1Description: https://datasheet.ciiva.com/11808/0900766b80fcdb72-11808686.pdf?src-supplier=RSComponents; ComponentLink2URL: https://datasheet.ciiva.com/7985/1856384-7985880.pdf?src-supplier=Element14; ComponentLink2Description: https://datasheet.ciiva.com/7985/1856384-7985880.pdf?src-supplier=Element14; ComponentLink3URL: https://datasheet.ciiva.com/22693/1902866-22693247.pdf?src-supplier=Element14; ComponentLink3Description: https://datasheet.ciiva.com/22693/1902866-22693247.pdf?src-supplier=Element14; ComponentLink4URL: https://datasheet.ciiva.com/5541/chpreztr-5541930.pdf?src-supplier=Mouser; ComponentLink4Description: https://datasheet.ciiva.com/5541/chpreztr-5541930.pdf?src-supplier=Mouser; Supplier Part Number 1: CR0805-FX-4700GLF
R415 = R1k-0805FTK: Res Thick Film 0805 1K Ohm 5% 1/8W ±200ppm/°C Molded SMD SMD Paper Tape on Plastic Reel; Manufacturer 1: Bourns; Voltage Rating (DC): 150V; Power Rating: 125mW; .Creator: GP; Supplier 1: Arrow Electronics; Manufacturer Part Number 1: CR0805-JW-102ELF; RoHS: Yes; Category: Chip SMD Resistors; Stock 1: 27510; Pricing 1: 1=0,05930, 10=0,03510, 25=0,01790, 100=0,00800, 250=0,00790, 500=0,00590, 1000=0,00360, 3000=0,00350, 6000=0,00250 (USD); Mount: Surface Mount; Case/Package: 0805; Number of Pins: 2; Contact Plating: Tin; Case Code (Metric): 2012; Case Code (Imperial): 0805; Min Operating Temperature: -55°C; Max Operating Temperature: 155°C; Resistor Type: Thick Film; Tolerance: 5%; Temperature Coefficient: 200ppm/°C; Features: Moisture Resistant; Package Quantity: 1; Packaging: Tape and Reel; Voltage Rating: 150V; Number of Terminations: 2; Termination: SMD/SMT; Max Power Dissipation: 125mW; Length: 2mm; Width: 1.25mm; Height: 0.5mm; Thickness: 508um; Depth: 1.25mm; Radiation Hardening: No; Lead Free: Lead Free; REACH SVHC: No SVHC; Military Standard: Not; ComponentLink1URL: https://datasheet.ciiva.com/11821/0900766b80fcdb72-11821134.pdf?src-supplier=RSComponents; ComponentLink1Description: https://datasheet.ciiva.com/11821/0900766b80fcdb72-11821134.pdf?src-supplier=RSComponents; ComponentLink2URL: https://datasheet.ciiva.com/15225/getdatasheetpartid-78155-15225381.pdf?src-supplier=Verical; ComponentLink2Description: https://datasheet.ciiva.com/15225/getdatasheetpartid-78155-15225381.pdf?src-supplier=Verical; ComponentLink3URL: https://datasheet.ciiva.com/22693/1902866-22693253.pdf?src-supplier=Element14; ComponentLink3Description: https://datasheet.ciiva.com/22693/1902866-22693253.pdf?src-supplier=Element14; ComponentLink4URL: https://datasheet.ciiva.com/7986/1856384-7986184.pdf?src-supplier=Element14; ComponentLink4Description: https://datasheet.ciiva.com/7986/1856384-7986184.pdf?src-supplier=Element14; ComponentLink5URL: https://datasheet.ciiva.com/7985/1856384-7985867.pdf?src-supplier=Element14; ComponentLink5Description: https://datasheet.ciiva.com/7985/1856384-7985867.pdf?src-supplier=Element14; ComponentLink6URL: https://datasheet.ciiva.com/30242/159chpreztr-30242765.pdf?src-supplier=Onlinecomponents.com; ComponentLink6Description: https://datasheet.ciiva.com/30242/159chpreztr-30242765.pdf?src-supplier=Onlinecomponents.com; ComponentLink7URL: https://datasheet.ciiva.com/6547/chpreztr-6547359.pdf?src-supplier=Digi-Key; ComponentLink7Description: https://datasheet.ciiva.com/6547/chpreztr-6547359.pdf?src-supplier=Digi-Key; Supplier Part Number 1: CR0805-JW-102ELF
R419-R422 = R10k-0805FTK: as R206 on sheet [2]MCU; Supplier 1: Arrow Electronics; Manufacturer 1: Bourns; Manufacturer Part Number 1: CR0805-JW-103ELF; RoHS: Yes; Category: Chip SMD Resistors; Stock 1: 57566; Pricing 1: 1=0,05790, 10=0,01540, 25=0,01340, 100=0,00340 (USD); Mount: Surface Mount; Case/Package: 0805; Number of Pins: 2; Contact Plating: Tin; Case Code (Metric): 2012; Case Code (Imperial): 0805; Min Operating Temperature: -55°C; Max Operating Temperature: 155°C; Tolerance: 5%; Resistor Type: Thick Film; Package Quantity: 1; Packaging: Tape and Reel; Number of Terminations: 2; Termination: SMD/SMT; Max Power Dissipation: 125mW; Features: Moisture Resistant; Series: CR0805; Construction: Rectangular; Resistance Tolerance: 5%; Technology: THICK FILM; Length: 2mm; Width: 1.25mm; Height: 0.5mm; Depth: 1.25mm; Thickness: 508um; Radiation Hardening: No; REACH SVHC: No SVHC; Military Standard: Not; RoHS Compliant: Yes; ComponentLink1URL: https://datasheet.ciiva.com/11821/0900766b80fcdb72-11821135.pdf?src-supplier=RSComponents; ComponentLink1Description: https://datasheet.ciiva.com/11821/0900766b80fcdb72-11821135.pdf?src-supplier=RSComponents; ComponentLink2URL: https://datasheet.ciiva.com/9122/chpreztr-9122374.pdf?src-supplier=Avnet; ComponentLink2Description: https://datasheet.ciiva.com/9122/chpreztr-9122374.pdf?src-supplier=Avnet; ComponentLink3URL: https://datasheet.ciiva.com/22693/1902866-22693254.pdf?src-supplier=Element14; ComponentLink3Description: https://datasheet.ciiva.com/22693/1902866-22693254.pdf?src-supplier=Element14; ComponentLink4URL: https://datasheet.ciiva.com/7986/691949-7986187.pdf?src-supplier=Element14; ComponentLink4Description: https://datasheet.ciiva.com/7986/691949-7986187.pdf?src-supplier=Element14; ComponentLink5URL: https://datasheet.ciiva.com/30065/159chpreztr-30065976.pdf?src-supplier=Onlinecomponents.com; ComponentLink5Description: https://datasheet.ciiva.com/30065/159chpreztr-30065976.pdf?src-supplier=Onlinecomponents.com; ComponentLink6URL: https://datasheet.ciiva.com/16783/70154685-16783482.pdf?src-supplier=Allied+Electronics; ComponentLink6Description: https://datasheet.ciiva.com/16783/70154685-16783482.pdf?src-supplier=Allied+Electronics; ComponentLink7URL: https://datasheet.ciiva.com/5548/chpreztr-5548491.pdf?src-supplier=Mouser; ComponentLink7Description: https://datasheet.ciiva.com/5548/chpreztr-5548491.pdf?src-supplier=Mouser; ComponentLink8URL: https://datasheet.ciiva.com/6559/chpreztr-6559900.pdf?src-supplier=Digi-Key; ComponentLink8Description: https://datasheet.ciiva.com/6559/chpreztr-6559900.pdf?src-supplier=Digi-Key; ComponentLink9URL: https://datasheet.ciiva.com/6559/chpreztr-6559901.pdf?src-supplier=Digi-Key; ComponentLink9Description: https://datasheet.ciiva.com/6559/chpreztr-6559901.pdf?src-supplier=Digi-Key; ComponentLink10URL: https://datasheet.ciiva.com/7985/1856384-7985869.pdf?src-supplier=Element14; ComponentLink10Description: https://datasheet.ciiva.com/7985/1856384-7985869.pdf?src-supplier=Element14; ComponentLink11URL: https://datasheet.ciiva.com/48692/001055517-da-01-en-smd-wid-cr0805-jw-103elf-10k-ohm-1-8w-48692118.pdf?src-supplier=Conrad; ComponentLink11Description: https://datasheet.ciiva.com/48692/001055517-da-01-en-smd-wid-cr0805-jw-103elf-10k-ohm-1-8w-48692118.pdf?src-supplier=Conrad; Supplier Part Number 1: CR0805-JW-103ELF
SW401-SW405 = SW_6x6
VR401 = Trimmer_10k_THT: as VR301 on sheet [3]Sensors; SnapEDA_Link: https://www.snapeda.com/parts/3362P-1-103LF/Bourns/view-part/?ref=snap; Package: 3362P-1 Bourns Inc.; Value: *; MF: Bourns; MP: 3362P-1-103LF; Check_prices: https://www.snapeda.com/parts/3362P-1-103LF/Bourns/view-part/?ref=eda